# Altium schematic sheet generate voltage.SchDoc
size 420 x 297 mm; SheetNumber: 5; SheetTotal: 5
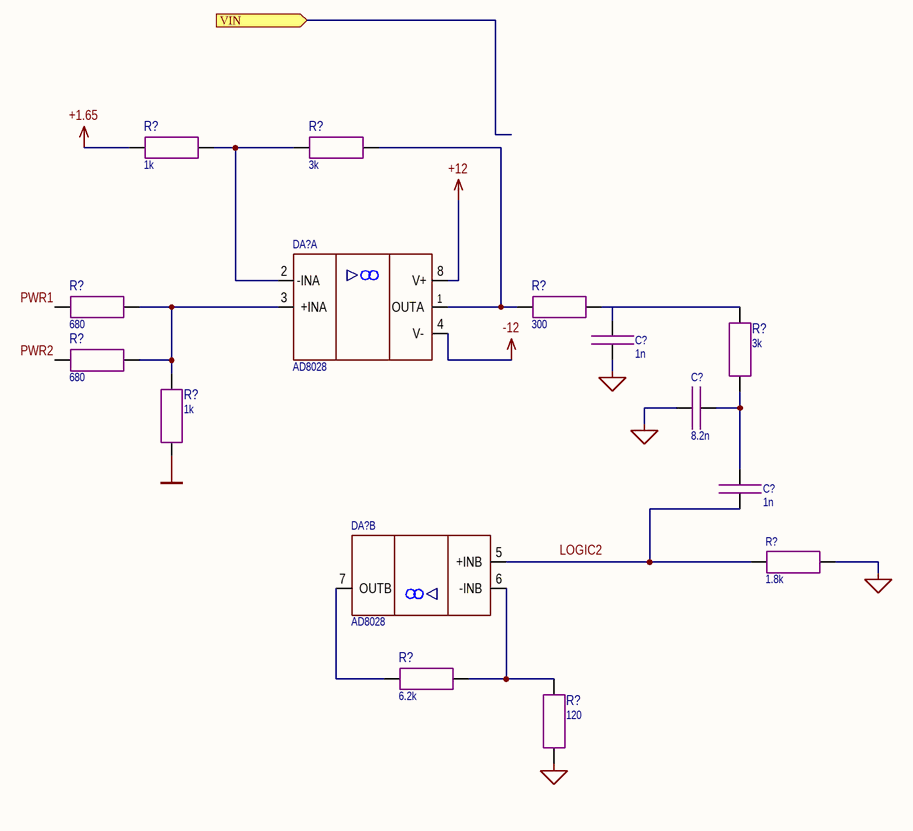
[diagram p0: generate voltage.SchDoc]

## Parts
(Parts that share a designator on the sheet are numbered #1, #2 ... from top to bottom, then left to right.)
C?#1  1n
C?#2  8.2n
C?#3  1n
DA?#1  AD8028  [IC: SOIC 8]  (part A of 2)
DA?#2  AD8028  [IC: SOIC 8]  (part B of 2)
R?#1  1k  [RES: SMD 0603 MD IPC 782]
R?#2  3k  [RES: SMD 0603 MD IPC 782]
R?#3  680  [RES: SMD 0603 MD IPC 782]
R?#4  300  [RES: SMD 0603 MD IPC 782]
R?#5  680  [RES: SMD 0603 MD IPC 782]
R?#6  3k  [RES: SMD 0603 MD IPC 782]
R?#7  1k  [RES: SMD 0603 MD IPC 782]
R?#8  1.8k
R?#9  6.2k  [RES: SMD 0603 MD IPC 782]
R?#10  120  [RES: SMD 0805 MD IPC 782]

## Ports
VIN (in)

## Nets
+1.65: R?#1.1
+12: DA?#1.8(V+)
-12: DA?#1.4(V-)
NetC?#1_1: C?#1.1 C?#2.2 R?#8.2 R?#10.1
NetC?#1_2: C?#1.2 R?#4.2 R?#6.2
NetC?#2_1: C?#2.1 C?#3.2 R?#6.1
NetC?#3_1: C?#3.1 DA?#2.5(+INB) R?#8.1
NetDA?#1_1: DA?#1.1(OUTA) R?#2.2 R?#4.1
NetDA?#1_2: DA?#1.2(-INA) R?#1.2 R?#2.1
NetDA?#1_3: DA?#1.3(+INA) R?#3.2 R?#5.2 R?#7.2
NetDA?#2_6: DA?#2.6(-INB) R?#9.2 R?#10.2
NetDA?#2_7: DA?#2.7(OUTB) R?#9.1

Not connected (* = marked no-connect by the designer): R?#3 1; R?#5 1; R?#7 1

## Notes on the sheet
- Labels drawn without touching a wire or pin: GNDD, LOGIC2, PWR1, PWR2
- Подп. и дата
- Инв. № дубл.
- Взам. инв. №
- Инв. № подл.
- Изм.
- Лист
- № докум.
- Подп.
- Дата
- 2.106-A3
- Копировал
- Формат А3

## Library data of the parts
C?#1 C?#3 = 1n 50V 0603 ±5%
C?#2 = 8.2n 50V 0805 5%
DA?#1 DA?#2 = AD8028_part
R?#1 R?#7 = 1k ±1% 0603: Code: 6069174188; Name: Резистор 1k ±1% 0603
R?#2 R?#6 = 3k ±1% 0603: Code: 6094357331; Name: Резистор 3К ±1% 0603
R?#3 R?#5 = 680 ±1% 0603: Code: 6069180761; Name: Резистор 680R ±1% 0603
R?#4 = 300 ±1% 0603: Code: 6069180661; Name: Резистор 300R±1% 0603
R?#8 = 1.8k ±1% 0603
R?#9 = 3.3k ±5% 0603
R?#10 = 51 ±1% 0805: Code: 6094354057; Name: Резистор 51K±1% 0805